# Altium schematic sheet Sheet1.SchDoc: D AMP
size A4; DocumentNumber: 0001; Revision: 1.0; SheetNumber: 1; SheetTotal: 5
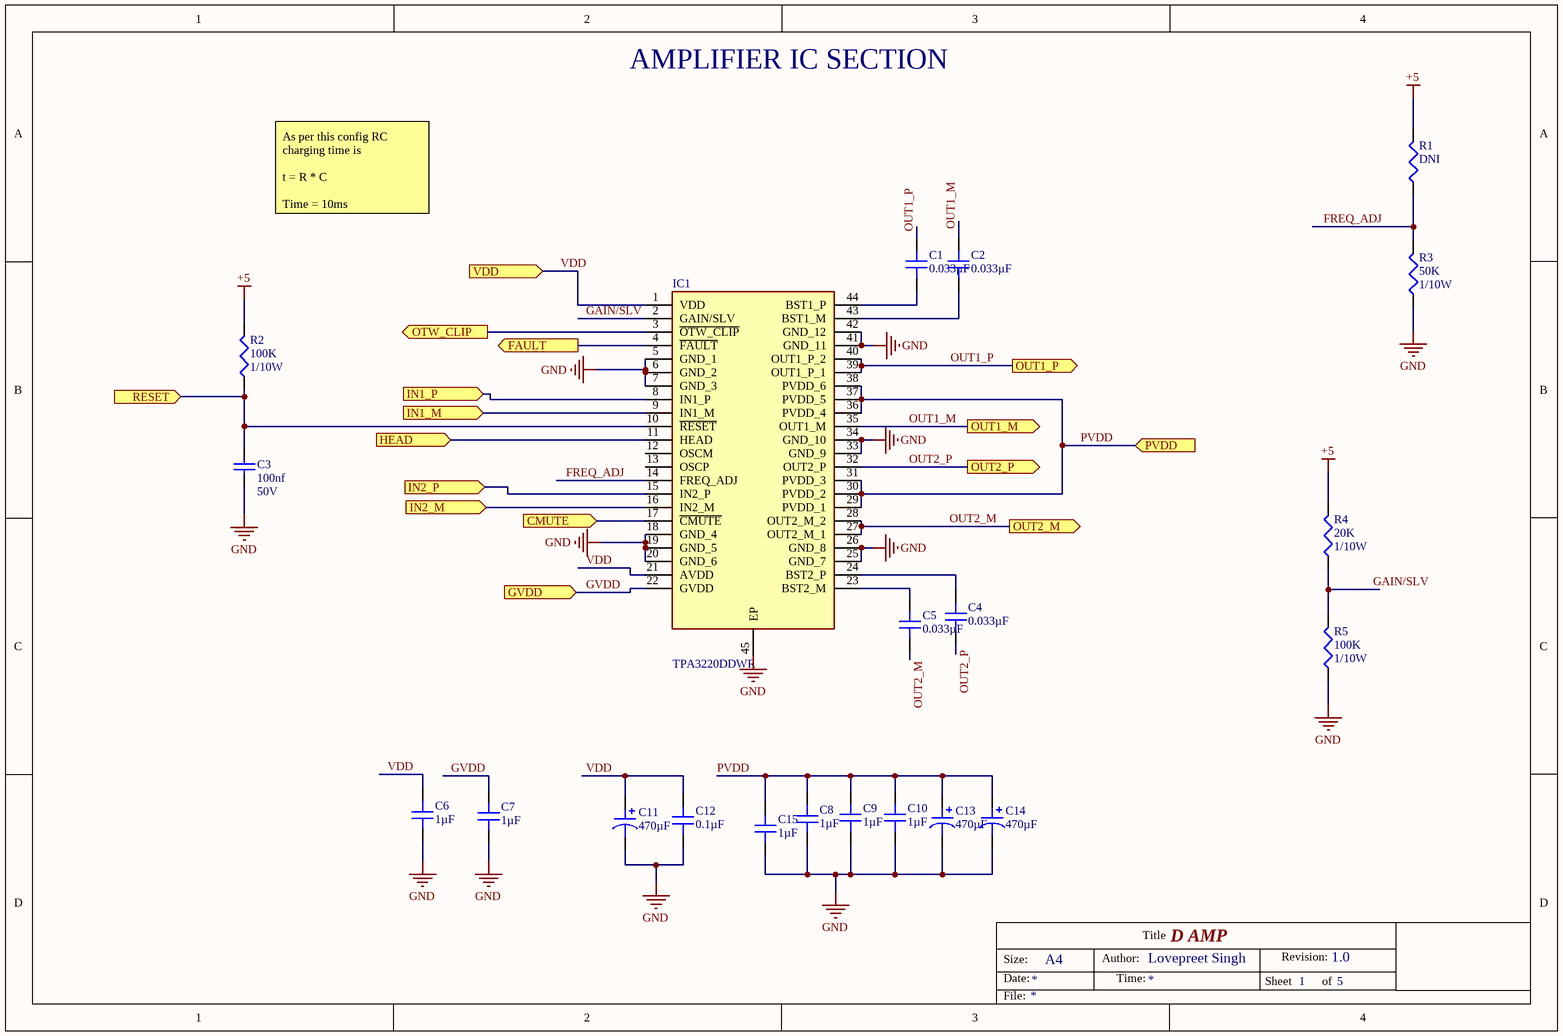
[diagram p0: Sheet1.SchDoc]

## Parts
C1  0.033µF  [CAP 0603_1608]
C2  0.033µF  [CAP 0603_1608]
C3  100nf  VRating: 50V  [C0603]
C4  0.033µF  [CAP 0603_1608]
C5  0.033µF  [CAP 0603_1608]
C6  1µF  [CAP 0805_2012]
C7  1µF  [CAP 0805_2012]
C8  1µF  [CAP 0805_2012]
C9  1µF  [CAP 0805_2012]
C10  1µF  [CAP 0805_2012]
C11  470µF  [CAP TH ALUM ELEC D12.50mm S5.00mm H27.00mm]
C12  0.1µF  [CAP 0805_2012]
C13  470µF  [CAP TH ALUM ELEC D12.50mm S5.00mm H27.00mm]
C14  470µF  [CAP TH ALUM ELEC D12.50mm S5.00mm H27.00mm]
C15  1µF  [CAP 0805_2012]
IC1  TPA3220DDWR  [SOP64P810X120-45N]
R1  DNI  [R0603]
R2  100K  PRating: 1/10W  [R0603]
R3  50K  PRating: 1/10W  [R0603]
R4  20K  PRating: 1/10W  [R0603]
R5  100K  PRating: 1/10W  [R0603]

## Ports
CMUTE (in), FAULT (out), GVDD (in), HEAD (in), IN1_M (in), IN1_P (in), IN2_M (in), IN2_P (in), OTW_CLIP (out), OUT1_M (out), OUT1_P (out), OUT2_M (out), OUT2_P (out), PVDD (in), RESET (in), VDD (in)

## Nets
+5: R1.2 R2.2 R4.2
GND: C3.1 C6.1 C7.1 C8.1 C9.1 C10.1 C11.2 C12.1 C13.2 C14.2 C15.1 IC1.5(GND_1) IC1.6(GND_2) IC1.7(GND_3) IC1.18(GND_4) IC1.19(GND_5) IC1.20(GND_6) IC1.25(GND_7) IC1.26(GND_8) IC1.33(GND_9) IC1.34(GND_10) IC1.41(GND_11) IC1.42(GND_12) IC1.45(EP) R3.1 R5.1
CMUTE: IC1.17(~{CMUTE}) ; port CMUTE
FAULT: IC1.4(~{FAULT}) ; port FAULT
FREQ_ADJ: IC1.14(FREQ_ADJ) R1.1 R3.2
GAIN/SLV: IC1.2(GAIN/SLV) R4.1 R5.2
GVDD: C7.2 IC1.22(GVDD) ; port GVDD
HEAD: IC1.11(HEAD) ; port HEAD
IN1_M: IC1.9(IN1_M) ; port IN1_M
IN1_P: IC1.8(IN1_P) ; port IN1_P
IN2_M: IC1.16(IN2_M) ; port IN2_M
IN2_P: IC1.15(IN2_P) ; port IN2_P
OTW_CLIP: IC1.3(~{OTW_CLIP}) ; port OTW_CLIP
OUT1_M: C2.2 IC1.35(OUT1_M) ; port OUT1_M
OUT1_P: C1.2 IC1.39(OUT1_P_1) IC1.40(OUT1_P_2) ; port OUT1_P
OUT2_M: C5.1 IC1.27(OUT2_M_1) IC1.28(OUT2_M_2) ; port OUT2_M
OUT2_P: C4.1 IC1.32(OUT2_P) ; port OUT2_P
PVDD: C8.2 C9.2 C10.2 C13.1 C14.1 C15.2 IC1.29(PVDD_1) IC1.30(PVDD_2) IC1.31(PVDD_3) IC1.36(PVDD_4) IC1.37(PVDD_5) IC1.38(PVDD_6) ; port PVDD
RESET: C3.2 IC1.10(~{RESET}) R2.1 ; port RESET
VDD: C6.2 C11.1 C12.2 IC1.1(VDD) IC1.21(AVDD) ; port VDD
NetC1_1: C1.1 IC1.44(BST1_P)
NetC2_1: C2.1 IC1.43(BST1_M)
NetC4_2: C4.2 IC1.24(BST2_P)
NetC5_2: C5.2 IC1.23(BST2_M)

Not connected (* = marked no-connect by the designer): IC1 12(OSCM) 13(OSCP)

## Notes on the sheet
- AMPLIFIER IC SECTION
- As per this config RC charging time is
  t = R * C
  Time = 10ms
- Size:
- Date:
- A4
- Author:
- Time:
- Title
- Lovepreet Singh
- Sheet
- Revision:
- of
- File:

## Library data of the parts
C1 C2 C4 C5 = C1608X8R2A333K080AB: CAP CER 0.033UF 100V X8R 0603; Manufacturer: TDK Corporation; Tolerance: ±10%; Part Number: C1608X8R2A333K080AB; Value: 0.033µF; Applications: General Purpose; Capacitance: 0.033µF; ComponentLink1Description: Datasheet; ComponentLink1URL: https://product.tdk.com/info/en/catalog/datasheets/mlcc_commercial_hightemp_en.pdf?ref_disty=digikey; ComponentLink2Description: DigiKey Link; ComponentLink2URL: http://digikey.com/product-detail/en/tdk-corporation/C1608X8R2A333K080AB/445-14287-1-ND/3955953; Device Package: 0603 (1608 Metric); Features: High Temperature; LastUpdated: 02-09-2020 01:03:34 AM; Lifecycle Status: Active; Minimum Order: 1; Mounting Type: Surface Mount, MLCC; Operating Temperature: -55°C ~ 150°C; Package / Case: 0603 (1608 Metric); Packaging: TapeAndReel; PartId: 3282; Part Status: Active; Price: 0.05; Series: C; Size / Dimension: 0.063" L x 0.031" W (1.60mm x 0.80mm); Supplier 1: DigiKey; Supplier Part Number 1: 445-14287-1-ND; Temperature Coefficient: X8R; Thickness (Max): 0.035" (0.90mm); Voltage - Rated: 100V
C3 = CAP-00018: CAP CER 100NF 10% 50V X7R 0603; Manufacturer 1: Yageo; Manufacturer 1 PN: CC0603KRX7R9BB104; Manufacturer 2 PN: GRM188R71H104KA93D; Manufacturer 3 PN: 06035C104KAT2A; SAP PN: 1100013274; SMD/TH: SMD; PB-Free: UNKNOWN; DB Ref: CAP-00018; Life Cycle: Released; Value: 100nf; Tolerence: 10%; TRating: X7R; Manufacturer 2: Murata; Manufacturer 3: AVX; ROHS Comp: YES; Operating Temp: -55°C to +125°C; Grade: UNKNOWN
C6-C10 C15 = GCM21BR71H105KA03L: CAP CER 1UF 50V X7R 0805; Manufacturer: Murata Electronics; Tolerance: ±10%; Part Number: GCM21BR71H105KA03L; Value: 1µF; Applications: Automotive; Capacitance: 1µF; ComponentLink1Description: Datasheet; ComponentLink1URL: https://www.murata.com/~/media/webrenewal/support/library/catalog/products/capacitor/mlcc/c03e.ashx?la=en-us; ComponentLink2Description: DigiKey Link; ComponentLink2URL: http://digikey.com/product-detail/en/murata-electronics/GCM21BR71H105KA03L/490-10675-1-ND/5251430; Device Package: 0805 (2012 Metric); LastUpdated: 02-09-2020 01:04:41 AM; Lifecycle Status: Active; Minimum Order: 1; Mounting Type: Surface Mount, MLCC; Operating Temperature: -55°C ~ 125°C; Package / Case: 0805 (2012 Metric); Packaging: TapeAndReel; PartId: 2659; Part Status: Active; Price: 0.08; Ratings: AEC-Q200; Series: GCM; Size / Dimension: 0.079" L x 0.049" W (2.00mm x 1.25mm); Supplier 1: DigiKey; Supplier Part Number 1: 490-10675-1-ND; Temperature Coefficient: X7R; Thickness (Max): 0.055" (1.40mm); Voltage - Rated: 50V
C11 C13 C14 = UBT1H471MHD: CAP 470UF 50V RAD; Manufacturer: Nichicon; Impedance: 55 mOhms; Lifetime @ Temp.: 10000 Hrs @ 125°C; Polarization: Polar; Ripple Current @ High Frequency: 1.65A @ 100kHz; Ripple Current @ Low Frequency: 825mA @ 120Hz; Tolerance: ±20%; Part Number: UBT1H471MHD; Applications: Automotive; Capacitance: 470µF; ComponentLink1Description: Datasheet; ComponentLink1URL: http://nichicon-us.com/english/products/pdfs/e-ubt.pdf; ComponentLink2Description: DigiKey Link; ComponentLink2URL: http://digikey.com/product-detail/en/nichicon/UBT1H471MHD/493-16220-ND/1832524; Device Package: Radial, Can; Height - Seated (Max): 1.063" (27.00mm); LastUpdated: 02-09-2020 01:32:15 AM; Lead Spacing: 0.197" (5.00mm); Lifecycle Status: Active; Minimum Order: 1; Mounting Type: Through Hole; Operating Temperature: -40°C ~ 125°C; Package / Case: Radial, Can; Packaging: Unknown; PartId: 15304; Part Status: Active; Price: 1.65; Series: UBT; Size / Dimension: 0.492" Dia (12.50mm); Supplier 1: DigiKey; Supplier Part Number 1: 493-16220-ND; Value: 470µF; Voltage - Rated: 50V
C12 = AC0805KKX8R9BB104: CAP CER 0805 10% X8R 50V 100NF; Manufacturer: Yageo; Part Number: AC0805KKX8R9BB104; Value: 0.1µF; Applications: Automotive; Capacitance: 0.1µF; ComponentLink1Description: Datasheet; ComponentLink1URL: http://www.yageo.com/documents/recent/AC0805KKX8R9BB104.pdf; ComponentLink2Description: DigiKey Link; ComponentLink2URL: http://digikey.com/product-detail/en/yageo/AC0805KKX8R9BB104/311-4624-1-ND/9699550; Device Package: 0805 (2012 Metric); LastUpdated: 02-09-2020 01:04:20 AM; Lifecycle Status: Active; Minimum Order: 1; Mounting Type: Surface Mount, MLCC; Operating Temperature: -55°C ~ 150°C; Package / Case: 0805 (2012 Metric); Packaging: TapeAndReel; PartId: 14076; Part Status: Active; Price: 0.06; Ratings: AEC-Q200; Series: AC; Size / Dimension: 0.079" L x 0.049" W (2.00mm x 1.25mm); Supplier 1: DigiKey; Supplier Part Number 1: 311-4624-1-ND; Temperature Coefficient: X8R; Thickness (Max): 0.057" (1.45mm); Tolerance: ±10%; Voltage - Rated: 50V
IC1 = TPA3220DDWR: Integrated Circuit; Manufacturer_Name: Texas Instruments; Datasheet Link: http://www.ti.com/lit/gpn/tpa3220; Height: 1.2mm; Mouser2 Part Number: 595-TPA3220DDWR; Mouser2 Price/Stock: https://www.mouser.com/Search/Refine.aspx?Keyword=595-TPA3220DDWR; Manufacturer_Part_Number: TPA3220DDWR
R1 R4 = RES-00050: RES SMD 20K 1% 1/10W 0603; Manufacturer 1: Yageo; Manufacturer 1 PN: RC0603FR-0720KL; Manufacturer 2 PN: AC0603FR-1020KL; Manufacturer 3 PN: RK73H1JTTD2002F; SAP PN: 1100013992; Tolerance(%): 1; Grade: UNKNOWN; DB Ref: RES-00050; Life Cycle: Released; Manufacturer 2: Yageo; Manufacturer 3: KOA Speer; ROHS Comp: YES; Operating Temp: -55°C to +125°C; SMD/TH: SMD; PB-Free: UNKNOWN
  R1: Value: DNI
  R4: Value: 20K
R2 R5 = RES-00024: RES SMD 100K 1% 1/10W 0603; Manufacturer 1: Yageo; Manufacturer 1 PN: RC0603FR-07100KL; Manufacturer 2 PN: RMCF0603FT100K; Manufacturer 3 PN: RK73H1JRTTD1003F; SAP PN: 1100013339; Tolerance(%): 1; Cost Price: $0.1; Grade: UNKNOWN; DB Ref: RES-00024; Life Cycle: Released; Value: 100K; Manufacturer 2: Stackpole; Manufacturer 3: KOA Speer; ROHS Comp: YES; Operating Temp: -55°C to +155°C; SMD/TH: SMD; PB-Free: UNKNOWN
R3 = RES-00125: RES 50K OHM 1% 1/10W 0603; Manufacturer 1: Yageo; Manufacturer 1 PN: RC0603FR-0750KL; SAP PN: 1100016036; Tolerance(%): 1; SMD/TH: SMD; Grade: UNKNOWN; DB Ref: RES-00125; Life Cycle: Released; Value: 50K; ROHS Comp: YES; Operating Temp: -55°C to +155°C; PB-Free: UNKNOWN